# Altium project Sp74.PrjPCB
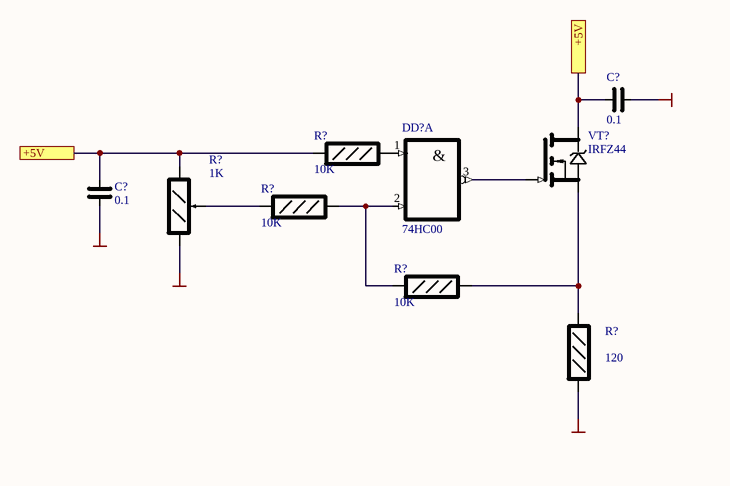
[diagram p0: sp74.SchDoc]
1 sheet, 9 parts. Net scope: flat (ports and power ports of the same name join across sheets).

## Sheet sp74.SchDoc
size A2; Organization: Altium Limited; Address1: L3, 12a Rodborough Rd; Address2: Frenchs Forest; Address3: NSW; Address4: Australia 2086

### Parts
(Parts that share a designator on the sheet are numbered #1, #2 ... from top to bottom, then left to right.)
C?#1  0.1  [CAPC1608X85N]
C?#2  0.1  [CAPC1608X85N]
DD?  74HC00  [SOIC_14-127]  (part A of 5)
R?#1  10K  [RESC1608X50N]
R?#2  1K  [TRIM_BOURNS_3296Y]
R?#3  10K  [RESC1608X50N]
R?#4  10K  [RESC1608X50N]
R?#5  120  [RESC1608X50N]
VT?  IRFZ44

### Ports
+5V

### Nets
GND: C?#1.2 C?#2.1 R?#2.2 R?#5.1
NetC?#1_1: C?#1.1 C?#2.2 R?#1.1 R?#2.1 VT?.2(D) ; port +5V
NetDD?_1: DD?.1(in1) R?#1.2
NetDD?_2: DD?.2(in2) R?#3.2 R?#4.1
NetDD?_3: DD?.3(OUT) VT?.1(G)
NetR?#2_3: R?#2.3 R?#3.1
NetR?#4_2: R?#4.2 R?#5.2 VT?.3(S)

### Notes on the sheet
- Title
- Size:
- Date:
- File:
- A2
- Number:
- Time:
- Revision:
- Sheet
- of
- (in symbol 74HC00, part A) &

### Library data of the parts
C?#1 C?#2 = CAP00603: Chip capasitor 0603; Vendor: Vishay; Unit Price: 0.1; Package: 0603; Value: 0.1
DD? = 74HC00: Quad 2 inverted AND; Vendor: NXP; Package: SOIC14; Unit Price: 0.2; Device: 74HC00
R?#1 R?#3-R?#5 = Res0603: Chip resistor 0603; Group: Passive; Vendor: Vishay; Unit Price: 0.005; Descr: Chip resistor 0603; Package: SMD0603
  R?#1 R?#3 R?#4: Value: 10K
  R?#5: Value: 120
R?#2 = 3296: Trimm Resistor; Vendor: BOURNS; Unit Price: 0.2; Package: Special Trimm3296; Value: 1K
VT? = IRFZ44: Adjustable voltage reference; Vendor: International Rectifier; Package: TO220; Unit Price: 1; Device: IRFZ44